# EAGLE design 555srvc (EAGLE 7.2.0)
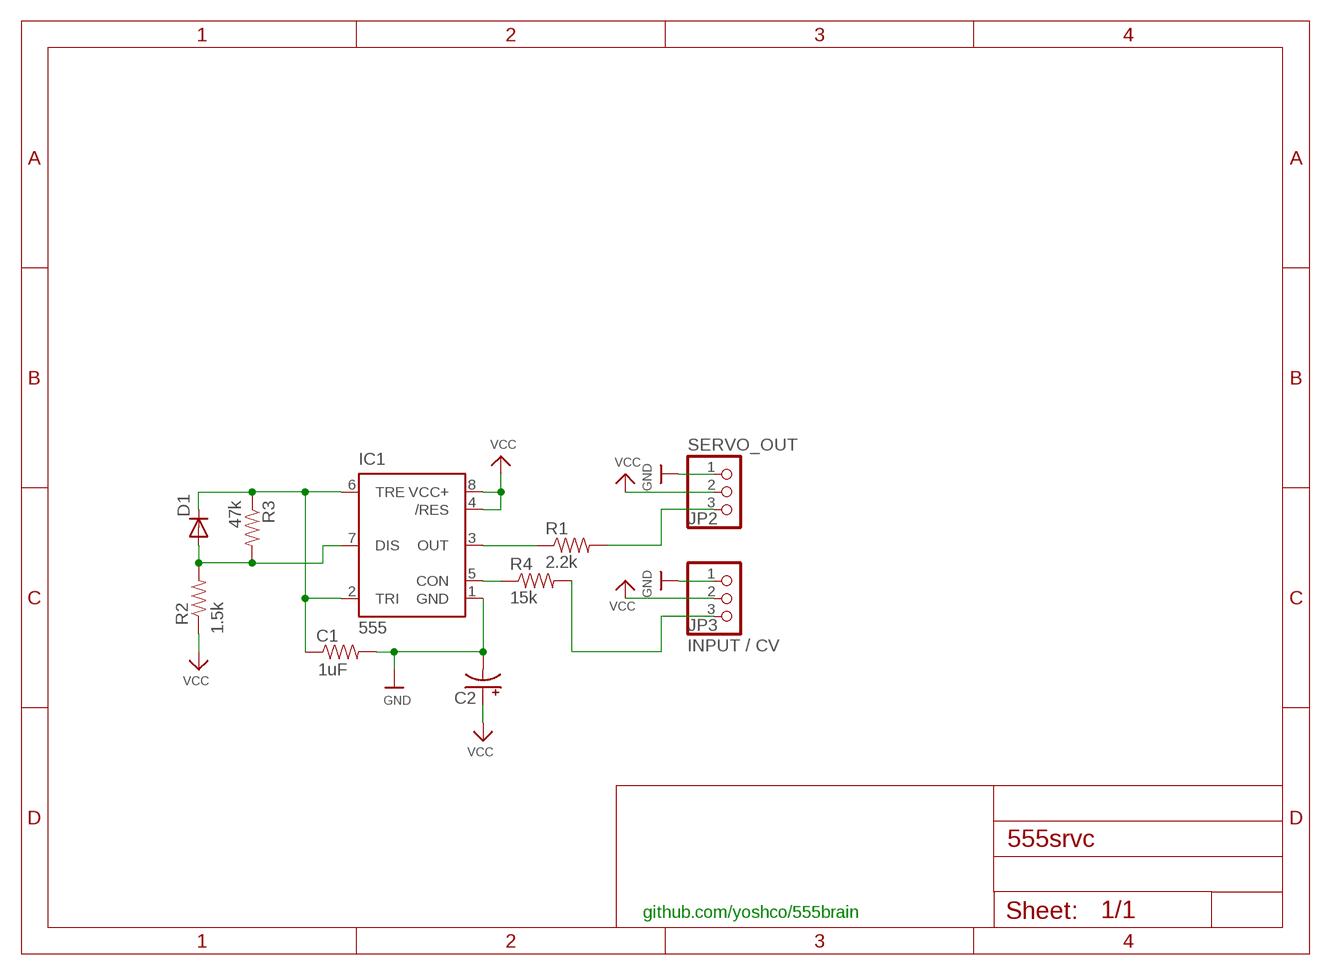
[diagram p0: schematic, sheet 1]

## Parts
C1  1uF  RESISTOR0805-RES  [0805]
C2  CPOL-USE5-6  [E5-6]
D1  DIODESOD-123  [SOD-123]
IC1  555  NE555D  [SO08]
JP2  SERVO_OUT  PINHD-1X3CB  [1X03-CLEANBIG]
JP3  INPUT / CV  PINHD-1X3CB  [1X03-CLEANBIG]
R1  2.2k  RESISTOR0805-RES  [0805]
R2  1.5k  RESISTOR0805-RES  [0805]
R3  47k  RESISTOR0805-RES  [0805]
R4  15k  RESISTOR0805-RES  [0805]

## Nets
GND: C1.2 C2.- IC1.1(GND) JP2.1 JP3.1
INPUT: JP3.3 R4.2
N$1: C1.1 D1.C IC1.2(TRI) IC1.6(TRE) R3.1
N$2: D1.A IC1.7(DIS) R2.2 R3.2
N$4: IC1.5(CON) R4.1
N$5: IC1.3(OUT) R1.1
SERVO_OUT: JP2.3 R1.2
VCC: C2.+ IC1.4(/RES) IC1.8(VCC+) JP2.2 JP3.2 R2.1

## Notes on the sheet
- github.com/yoshco/555brain

## Library data of the parts
C1 R1-R4 = 555srvc:RESISTOR: Resistor Basic schematic elements and footprints for 0603, 1206, and PTH resistors.
C2 = 555srvc:CPOL-US: POLARIZED CAPACITOR, American symbol
D1 = 555srvc:DIODE: Diode SMA Model Volts Amps Type Vf Vr Digikey # Notes SSA34-E3 40V 3A Schottky 480mV @ 3A 200uA @ 40V SSA34-E3/61TGITR-ND CDBA120-G 20V 1A Schottky 500mV @ 1A 500uA @ 20V 641-1014-6-ND REEL MBRA210 10V 2A Schottky 350mV @ 2A 700uA @ 10V MBRA210LT3 SOD-123 Model Volts Amps Type Vf Vr Order # Notes BAT54T1G 30V 200mA Schottky 800mV @ 200mA 2uA @ 25V BAT54T1GOSTR-ND B0530W 30V 500mA Schottky 430mV @ 500mA 130uA @ 30V B0530W-FDICT-ND REEL MBR120 1A 20V Schottky 340mV @ 1A MBR120VLSFT1GOSCT-ND SOD-323 Model Volts Amps Type Vf Vr Order # Notes PMEG2005EJ 20V 500mA Schottky 355mV @ 500mA 568-4110-1-ND ZLLS410 10V 570mA Schottky 380mV @ 570mA ZLLS410CT-ND 1N4148WS 75V 150mA Silicon/Simple 1V 1N4148WSFSCT-ND REEL SOD-523 Model Volts Amps Type Vf Vr Order # Notes BAT54XV2 30V 200mA Schottky 0.8V @ 100mA BAT54XV2CT-ND TB751S 30V 30mA Schottky RB751S-40TE61CT-ND SOT23-R/W (R = Solder Paste/Reflow Ovens, W = Hand-Soldering) Model Volts Amps Type Vf Vr Order # Notes BAT54FILM 40V 300mA Schottky 497-7162-1-ND
IC1 = 555srvc:NE555: General purpose bipolar Timer
JP2 JP3 = 555srvc:PINHD-1X3: PIN HEADER

## Board
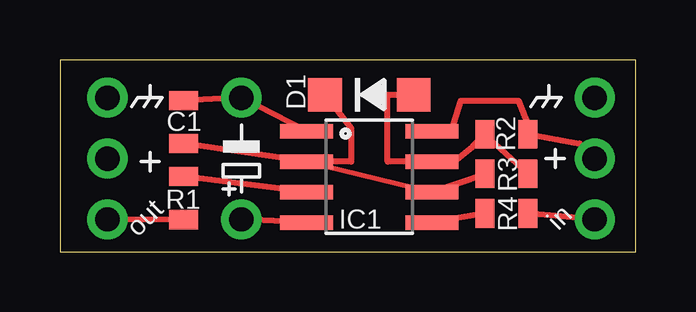
[diagram p1: board, top side]
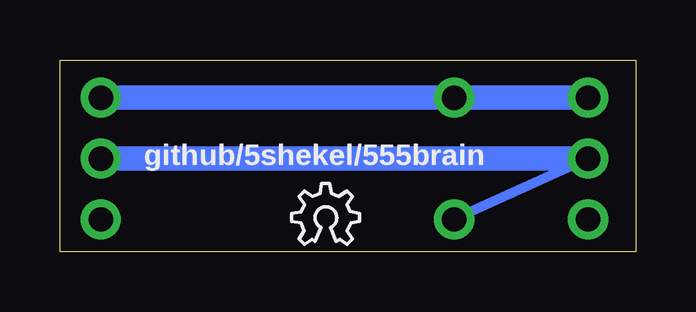
[diagram p2: board, bottom side, seen from below]

Size 24 x 8 mm. Coordinates in mm from the lower left corner, seen from the top.
Outline: 0,0 24,0 24,8 0,8 0,0
Copper layers (1*16): Top 0.035mm / dielectric 1.5mm / Bottom 0.035mm
Design rules "smartporot-EagleRules": minimum track width 7mil, minimum drill 12mil, track to track 7mil, track to pad 7mil, pad to pad 7mil, via to via 7mil, smd to smd 0mil, copper to edge 20mil, drill to drill 10mil, minimum pad ring 10mil, minimum via ring 6mil, stop-mask expansion 2mil, vias tented up to drill 25mil, thermal gap 10mil

### Footprints (pad centres in the part's own frame; a part is rotated, then mirrored left to right if it is on the bottom)
0805 = smd 0.8 x 1.2: 1 -0.9,0; 2 0.9,0
E5-6 = drill 1.016 pad 1.677: + -2.54,0 | drill 1.016 pad 1.676: - 2.54,0
SOD-123 = smd 1.4 x 1.4: A 1.85,0; C -1.85,0
SO08 = smd 0.61 x 2.21: 1 -1.905,-2.616; 2 -0.635,-2.616; 3 0.635,-2.616; 4 1.905,-2.616; 5 1.905,2.616; 6 0.635,2.616; 7 -0.635,2.616; 8 -1.905,2.616
1X03-CLEANBIG = drill 1.016 pad 1.676: 1 -2.54,0; 2 0,0; 3 2.54,0

### Placement (x,y rotation side)
C1  5.15,5.41 90 top
C2  7.57,3.88 90 top
D1  12.9,6.55 0 top
IC1  12.9,3.12 270 top
JP2  1.98,3.88 270 top
JP3  22.3,3.88 270 top
R1  5.15,2.23 270 top
R2  18.61,4.9 180 top
R3  18.61,3.25 0 top
R4  18.61,1.6 0 top
U$5  [OSHW_6X100_NOTEXT]  14.34,0.3 0 bottom

### Tracks (layer width: path | path; a pad name or v marks a point on that pad's centre or on a via)
GND
  Top 0.254: C1.2 C2.- IC1.1
  Bottom 1.016: JP3.1 C2.- JP2.1
INPUT
  Top 0.254: JP3.3 R4.2
N$1
  Top 0.203: IC1.2 IC1.6
  Top 0.254: D1.C 12.14,5.15 12.14,3.76 IC1.2 C1.1 | IC1.6 R3.1
N$2
  Top 0.254: D1.A 13.66,6.55 13.66,3.76 IC1.7 16.46,3.76 17.22,4.39 17.22,4.4 R2.2 17.86,4.52 18.12,4.52 R3.2
N$4
  Top 0.254: R4.1 IC1.5
N$5
  Top 0.254: IC1.3 R1.1
SERVO_OUT
  Top 0.254: R1.2 JP2.3
VCC
  Top 0.254: IC1.4 C2.+ | IC1.8 16.33,5.03 16.71,6.3 19.12,6.3 19.5,5.28 19.5,4.53 R2.1 21.66,4.52 JP3.2
  Bottom 0.406: JP2.2 C2.+
  Bottom 1.016: JP3.2 JP2.2

### Text on the board
tPlace: out | in
bNames: github/5shekel/555brain